# EAGLE design m0_lora (EAGLE 9.2.0)
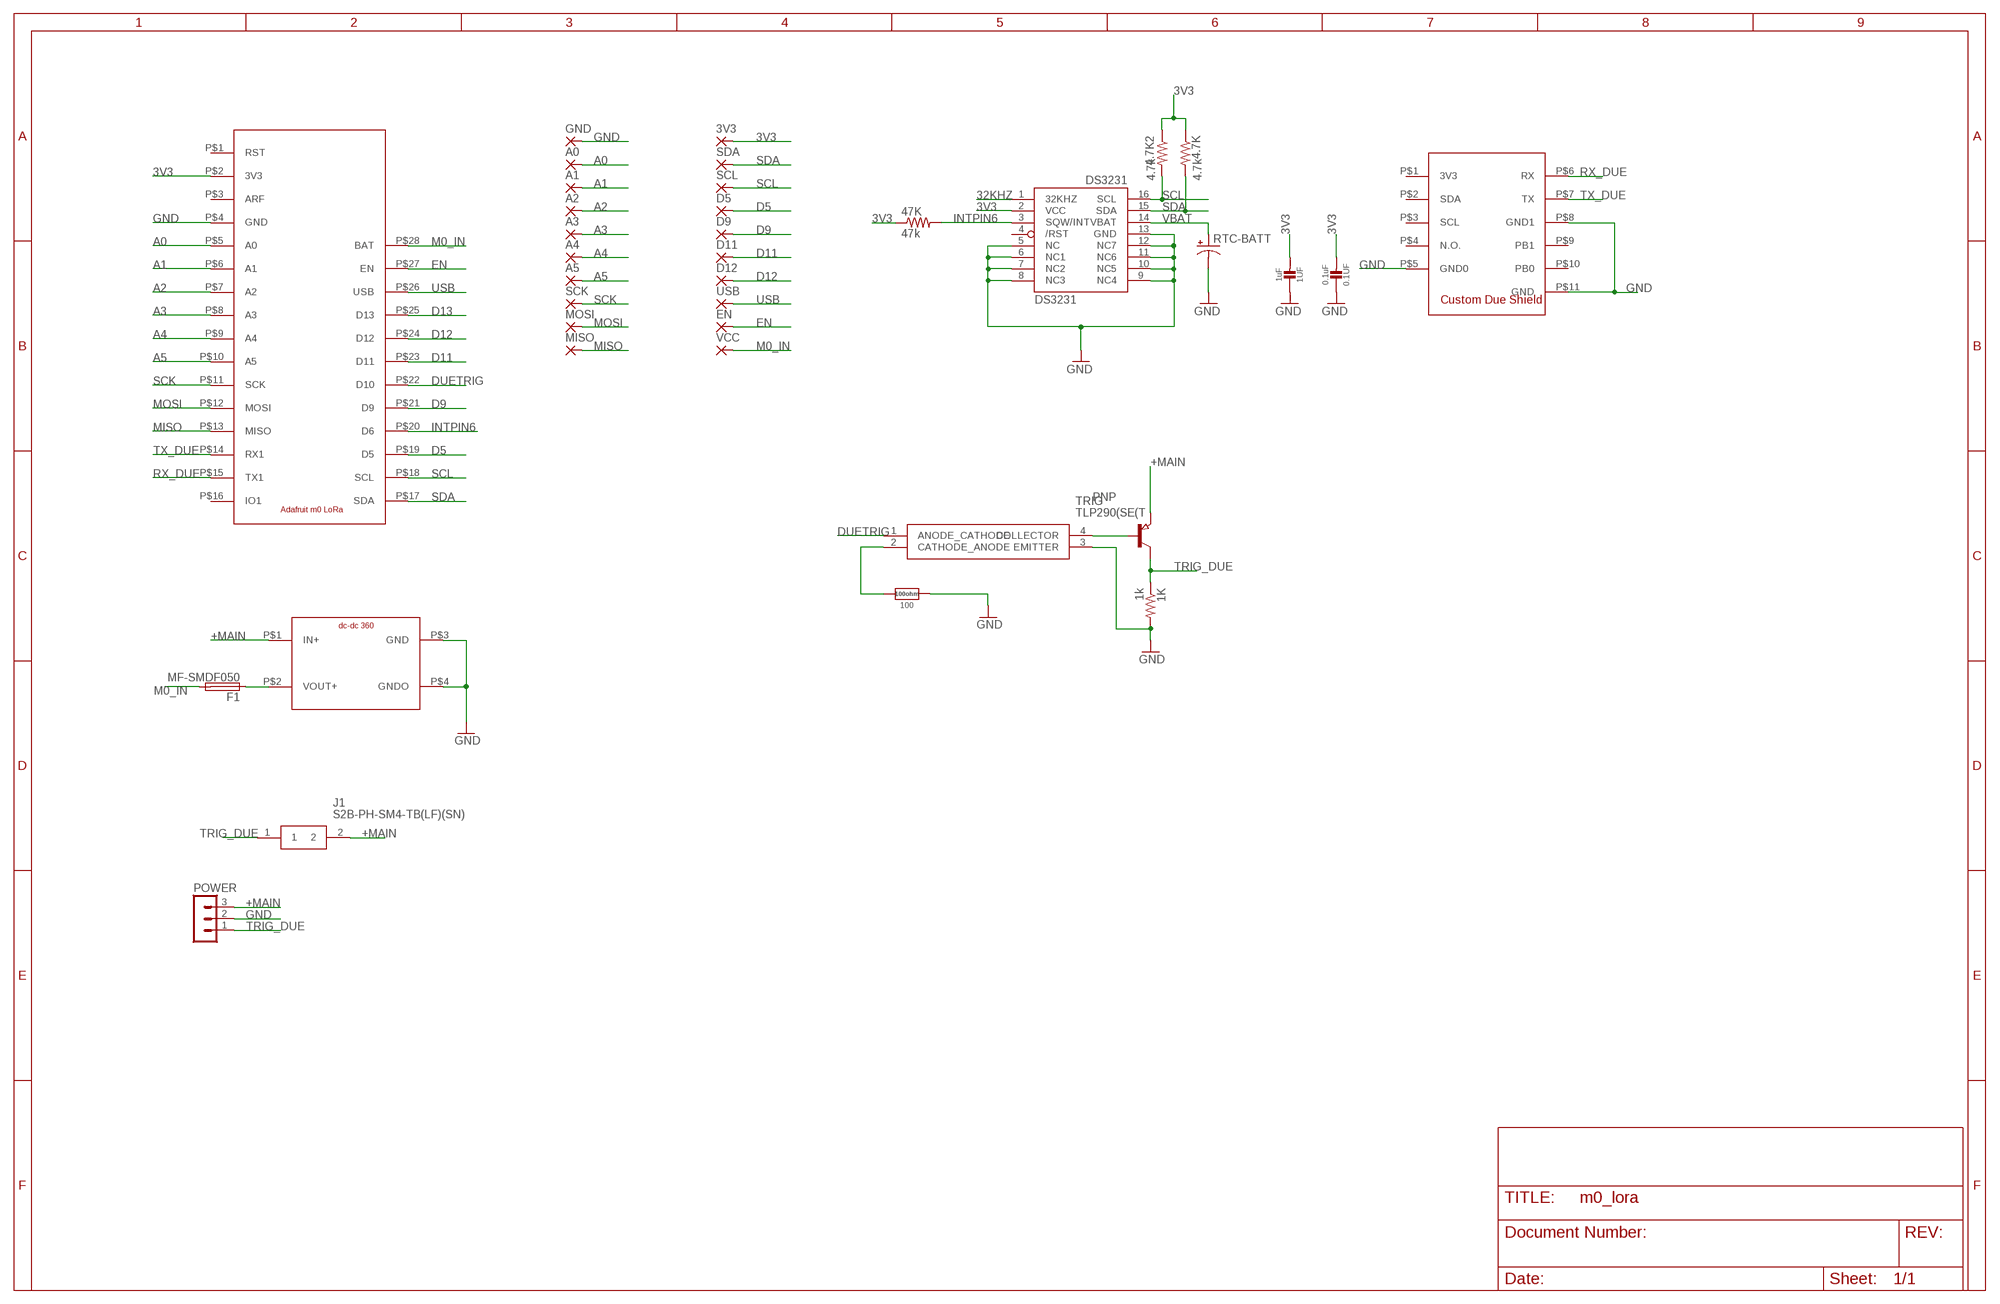
[diagram p0: schematic, sheet 1]

## Parts
0.1UF  0.1uF  CAP_CERAMIC0805-NOOUTLINE  [0805-NO]
1K  1k  R-US_R0805  [R0805]
1UF  1uF  CAP_CERAMIC0805-NOOUTLINE  [0805-NO]
3V3  SMD2  [SMD1,27-2,54]
4.7K  4.7k  R-US_R0805  [R0805]
4.7K2  4.7k  R-US_R0805  [R0805]
47K  47k  R-US_R0805  [R0805]
100  100ohm  RESISTOR0805_NOOUTLINE  [0805-NO]
A0  SMD2  [SMD1,27-2,54]
A1  SMD2  [SMD1,27-2,54]
A2  SMD2  [SMD1,27-2,54]
A3  SMD2  [SMD1,27-2,54]
A4  SMD2  [SMD1,27-2,54]
A5  SMD2  [SMD1,27-2,54]
D5  SMD2  [SMD1,27-2,54]
D9  SMD2  [SMD1,27-2,54]
D11  SMD2  [SMD1,27-2,54]
D12  SMD2  [SMD1,27-2,54]
DS3231  DS3231/SO  [SO16W]
EN  SMD2  [SMD1,27-2,54]
F1  MF-SMDF050  [MF-SMDF050]
GND  SMD2  [SMD1,27-2,54]
J1  S2B-PH-SM4-TB(LF)(SN)  [S2B-PH-SM4-TB]
MISO  SMD2  [SMD1,27-2,54]
MOSI  SMD2  [SMD1,27-2,54]
PNP  PNP-TRANSISTOR_SOT23  [SOT23]
POWER  MA03-1  [MA03-1]
RTC-BATT  CAP_POL6032  [EIA6032]
SCK  SMD2  [SMD1,27-2,54]
SCL  SMD2  [SMD1,27-2,54]
SDA  SMD2  [SMD1,27-2,54]
TRIG  TLP290(SE(T  [SOIC127P700X220-4N]
U$1  M0_LORA  [RFM69]
U$5  MINI-DC-DCDC-DC-2  [MINI-DC-DC-2]
U$6  DUE_PADS  [DUESHIELD]
USB  SMD2  [SMD1,27-2,54]
VCC  SMD2  [SMD1,27-2,54]

## Nets
3V3: 0.1UF.2 1UF.2 3V3.1(P) 4.7K2.1 4.7K.1 47K.1 DS3231.2(VCC) U$1.P$2(3V3)
32KHZ: DS3231.1(32KHZ)
+MAIN: J1.2 PNP.2(E) POWER.3 U$5.P$1(IN+)
A0: A0.1(P) U$1.P$5(A0)
A1: A1.1(P) U$1.P$6(A1)
A2: A2.1(P) U$1.P$7(A2)
A3: A3.1(P) U$1.P$8(A3)
A4: A4.1(P) U$1.P$9(A4)
A5: A5.1(P) U$1.P$10(A5)
D5: D5.1(P) U$1.P$19(D5)
D9: D9.1(P) U$1.P$21(D9)
D11: D11.1(P) U$1.P$23(D11)
D12: D12.1(P) U$1.P$24(D12)
D13: U$1.P$25(D13)
DUETRIG: TRIG.1(ANODE_CATHODE) U$1.P$22(D10)
EN: EN.1(P) U$1.P$27(EN)
GND: 0.1UF.1 1K.2 1UF.1 100.1 DS3231.5(NC) DS3231.6(NC1) DS3231.7(NC2) DS3231.8(NC3) DS3231.9(NC4) DS3231.10(NC5) DS3231.11(NC6) DS3231.12(NC7) DS3231.13(GND) GND.1(P) POWER.2 RTC-BATT.P$2(-) TRIG.3(EMITTER) U$1.P$4(GND) U$5.P$3(GND) U$5.P$4(GNDO) U$6.P$5(GND0) U$6.P$8(GND1) U$6.P$11(GND)
INTPIN6: 47K.2 DS3231.3(SQW/INT) U$1.P$20(D6)
M0_IN: F1.2 U$1.P$28(BAT) VCC.1(P)
MISO: MISO.1(P) U$1.P$13(MISO)
MOSI: MOSI.1(P) U$1.P$12(MOSI)
N$1: F1.1 U$5.P$2(VOUT+)
N$7: PNP.1(B) TRIG.4(COLLECTOR)
N$16: 100.2 TRIG.2(CATHODE_ANODE)
RX_DUE: U$1.P$15(TX1) U$6.P$6(RX)
SCK: SCK.1(P) U$1.P$11(SCK)
SCL: 4.7K2.2 DS3231.16(SCL) SCL.1(P) U$1.P$18(SCL)
SDA: 4.7K.2 DS3231.15(SDA) SDA.1(P) U$1.P$17(SDA)
TRIG_DUE: 1K.1 J1.1 PNP.3(C) POWER.1
TX_DUE: U$1.P$14(RX1) U$6.P$7(TX)
USB: U$1.P$26(USB) USB.1(P)
VBAT: DS3231.14(VBAT) RTC-BATT.P$1(+)
Unconnected: DS3231.4(/RST) U$1.P$1(RST) U$1.P$3(ARF) U$1.P$16(IO1) U$6.P$1(3V3) U$6.P$2(SDA) U$6.P$3(SCL) U$6.P$4(N.O.) U$6.P$9(PB1) U$6.P$10(PB0)

## Library data of the parts
0.1UF 1UF = microbuilder:CAP_CERAMIC: Ceramic Capacitors For new designs, use the packages preceded by an '_' character since they are more reliable: The following footprints should be used on most boards: _0402 - Standard footprint for regular board layouts _0603 - Standard footprint for regular board layouts _0805 - Standard footprint for regular board layouts _1206 - Standard footprint for regular board layouts For extremely tight-pitch boards where space is at a premium, the following 'micro-pitch' footprints can be used (smaller pads, no silkscreen outline, etc.): _0402MP - Micro-pitch footprint for very dense/compact boards _0603MP - Micro-pitch footprint for very dense/compact boards _0805MP - Micro-pitch footprint for very dense/compact boards _1206MP - Micro-pitch footprint for very dense/compact boards
1K 4.7K 4.7K2 47K = rcl:R-US_: RESISTOR, American symbol; SPICEPREFIX: R
3V3 A0 A1-A5 D5 D9 D11 D12 EN GND MISO MOSI SCK SCL SDA USB VCC = wirepad:SMD2: SMD PAD
100 = microbuilder:RESISTOR: Resistors For new designs, use the packages preceded by an '_' character since they are more reliable: The following footprints should be used on most boards: _0402 - Standard footprint for regular board layouts _0603 - Standard footprint for regular board layouts _0805 - Standard footprint for regular board layouts _1206 - Standard footprint for regular board layouts For extremely tight-pitch boards where space is at a premium, the following 'micro-pitch' footprints can be used (smaller pads, no silkscreen outline, etc.): _0402MP - Micro-pitch footprint for very dense/compact boards _0603MP - Micro-pitch footprint for very dense/compact boards _0805MP - Micro-pitch footprint for very dense/compact boards _1206MP - Micro-pitch footprint for very dense/compact boards
DS3231 = adafruit:DS3231
F1 = fuse:MF-SMDF: MF-SMDF Series - PRC Resettable Fuses Source: http://www.farnell.com/datasheets/716597.pdf
J1 = S2B-PH-SM4-TB(LF)(SN):S2B-PH-SM4-TB(LF)(SN): PH SMT side entry shroud header 2 way JST PH Series, 2mm Pitch 2 Way 1 Row Right Angle PCB Header, Solder Termination, 2A Source: Datasheet <http://uk.rs-online.com/web/p/products/6881353P>; DESCRIPTION: PH SMT side entry shroud header 2 way JST PH Series, 2mm Pitch 2 Way 1 Row Right Angle PCB Header, Solder Termination, 2A; HEIGHT: mm; MANUFACTURER_NAME: JST (JAPAN SOLDERLESS TERMINALS); MANUFACTURER_PART_NUMBER: S2B-PH-SM4-TB(LF)(SN); RS_PART_NUMBER: 6881353P; RS_PRICE-STOCK: http://uk.rs-online.com/web/p/products/6881353P
PNP = semicon-smd-ipc:PNP-TRANSISTOR_: PNP TRANSISTOR
POWER = con-lstb:MA03-1: PIN HEADER; OC_FARNELL: unknown; OC_NEWARK: unknown
RTC-BATT = SparkFun-Passives:CAP_POL: Capacitor Polarized These are standard SMD and PTH capacitors. Normally 10uF, 47uF, and 100uF in electrolytic and tantalum varieties. Always verify the external diameter of the through hole cap, it varies with capacity, voltage, and manufacturer. The EIA devices should be standard.
TRIG = SamacSys_Parts:TLP290(SE(T: Photocoupler, Tr, 2.3mm, AC, SO4 Source: Datasheet <http://uk.rs-online.com/web/p/products/8851086P>; DESCRIPTION: Photocoupler, Tr, 2.3mm, AC, SO4; HEIGHT: 2.2mm; MANUFACTURER_NAME: Toshiba; MANUFACTURER_PART_NUMBER: TLP290(SE(T; RS_PART_NUMBER: 8851086P; RS_PRICE-STOCK: http://uk.rs-online.com/web/p/products/8851086P
U$1 = m0_LoRa:M0_LORA
U$5 = mini DC-DC 360:MINI-DC-DC
U$6 = due_shield_pad:DUE_PADS

## Board
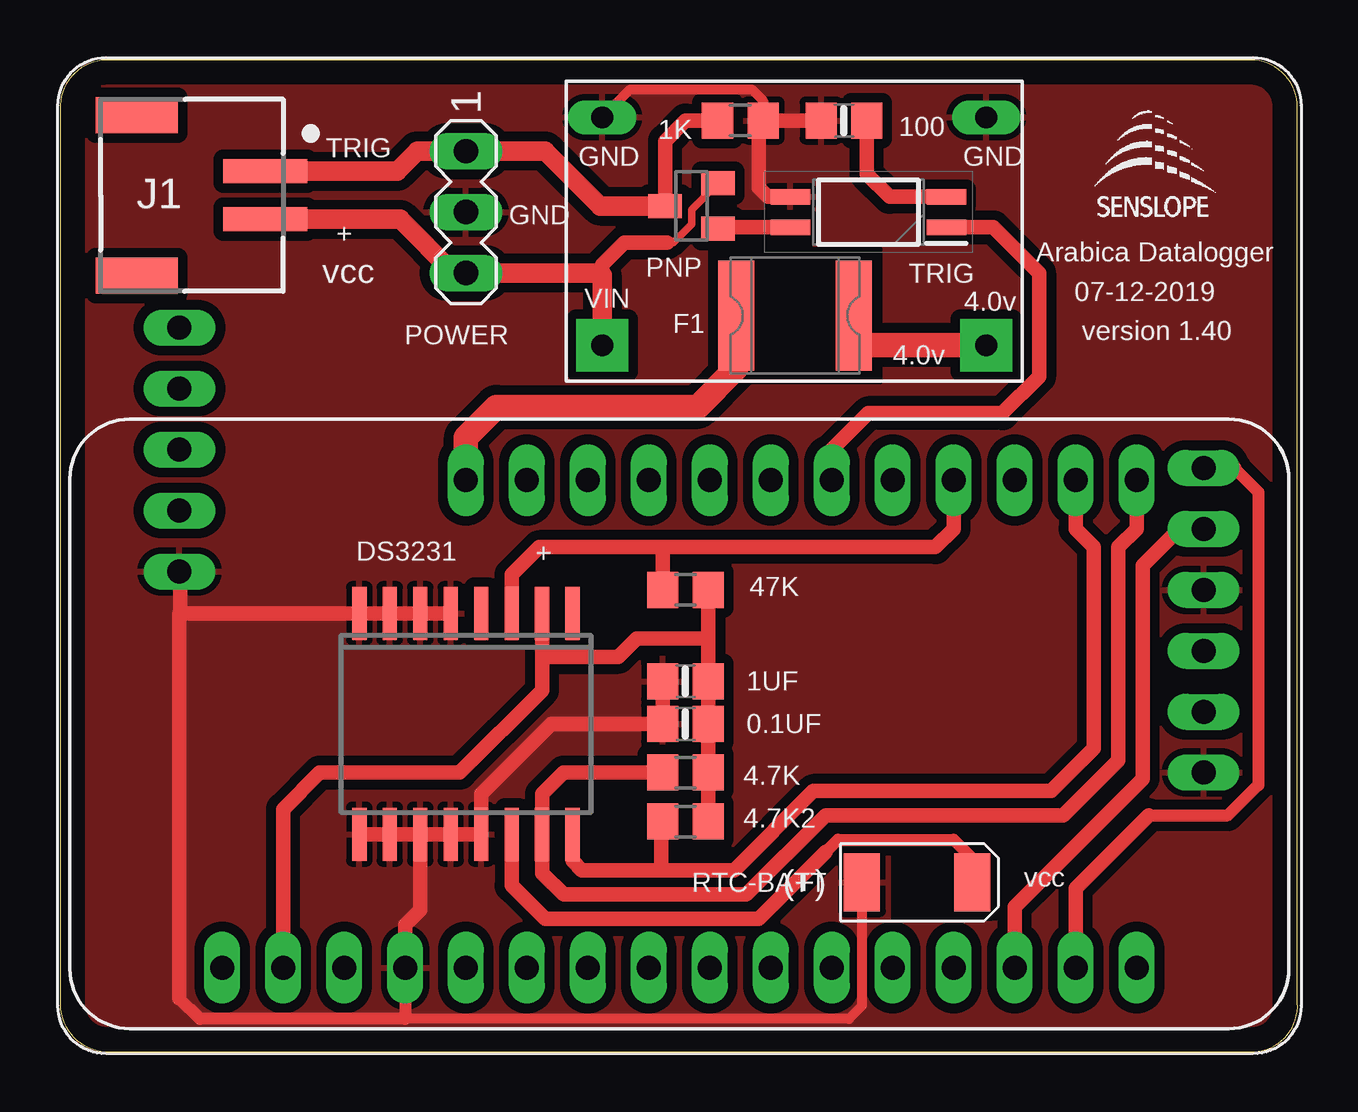
[diagram p1: board, top side]
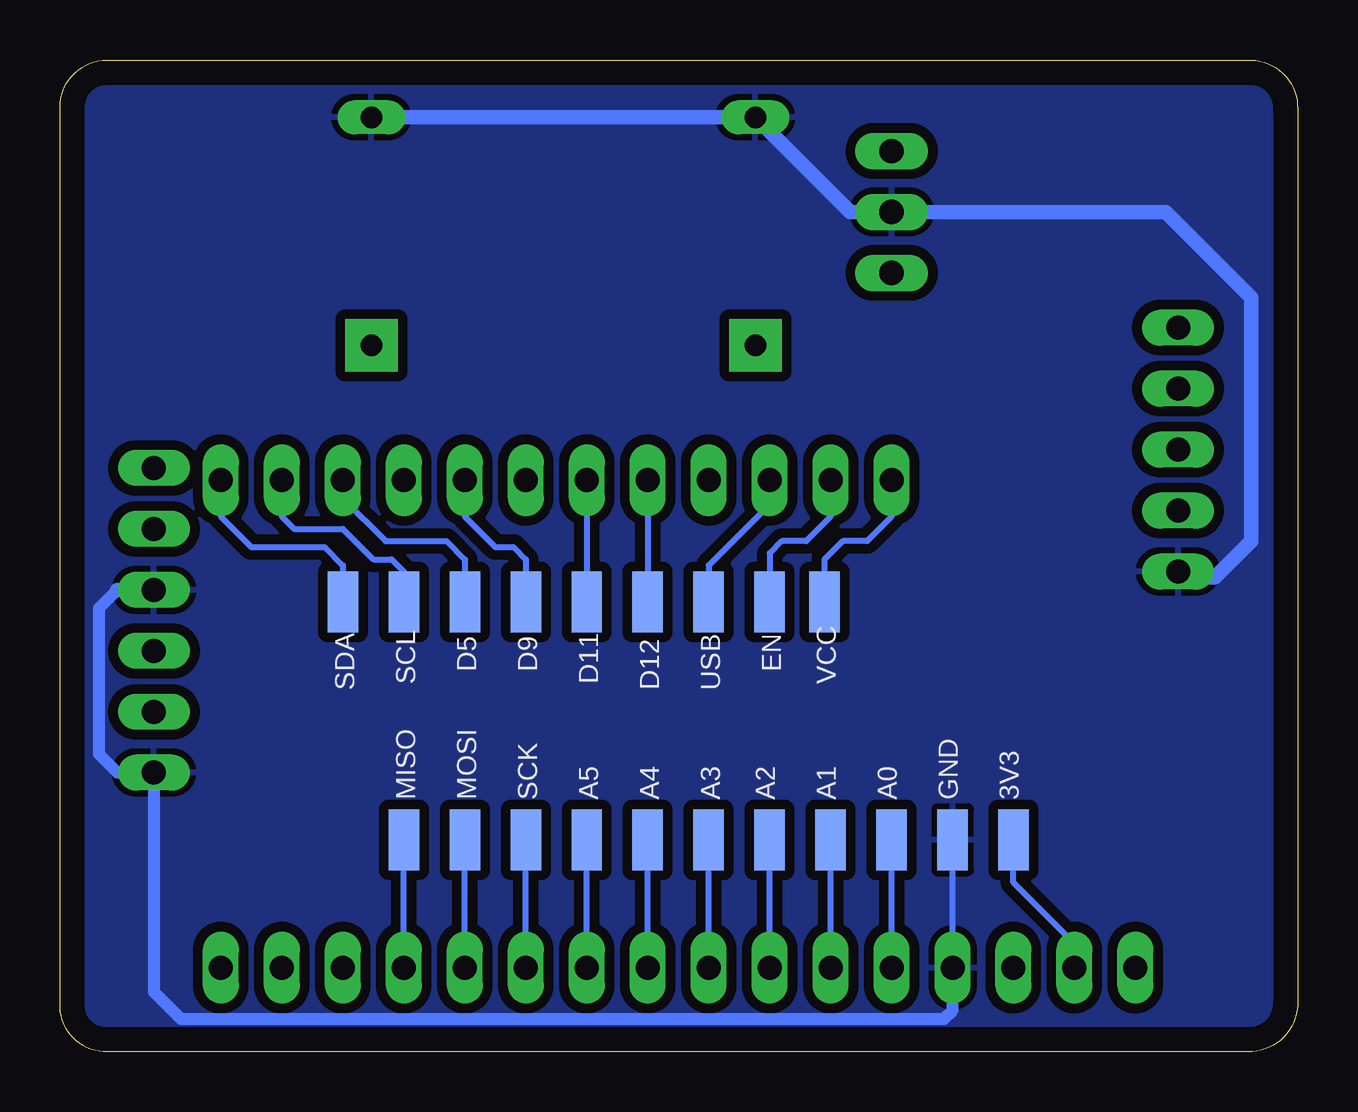
[diagram p2: board, bottom side, seen from below]

Size 51.56 x 41.34 mm. Coordinates in mm from the lower left corner, seen from the top.
Outline: 49.61,41.34 1.93,41.34 arc90 0,39.28 0,1.96 arc90 2.08,0 49.76,0 arc90 51.56,2.03 51.56,39.36 arc90 49.61,41.34
Copper layers (1*16): Top 0.035mm / dielectric 1.5mm / Bottom 0.035mm
Design rules "default": minimum track width 6mil, minimum drill 0.35mm, track to track 6mil, track to pad 6mil, pad to pad 6mil, via to via 6mil, smd to smd 6mil, copper to edge 40mil, drill to drill 6mil, minimum pad ring 10mil, minimum via ring 8mil, stop-mask expansion 4mil, vias tented up to drill 0mil, thermal gap 10mil

### Footprints (pad centres in the part's own frame; a part is rotated, then mirrored left to right if it is on the bottom)
0805-NO = smd 1.3 x 1.5: 1 -0.95,0; 2 0.95,0
R0805 = smd 1.3 x 1.5: 1 -0.95,0; 2 0.95,0
SMD1,27-2,54 = smd 1.27 x 2.54: 1 0,0
SO16W = smd 0.6 x 2.2: 1 -4.445,-4.6; 2 -3.175,-4.6; 3 -1.905,-4.6; 4 -0.635,-4.6; 5 0.635,-4.6; 6 1.905,-4.6; 7 3.175,-4.6; 8 4.445,-4.6; 9 4.445,4.6; 10 3.175,4.6; 11 1.905,4.6; 12 0.635,4.6; 13 -0.635,4.6; 14 -1.905,4.6; 15 -3.175,4.6; 16 -4.445,4.6
MF-SMDF050 = smd 1.5 x 4.6: 1 -2.45,0; 2 2.45,0
S2B-PH-SM4-TB = smd 1 x 3.5: 1 5,0.75; 2 3,0.75 | smd 1.5 x 3.4: 3 0.65,6.1; 4 7.35,6.1
SOT23 = smd 1 x 1.4: 1 -0.95,-1.1; 2 0.95,-1.1; 3 0,1.1
MA03-1 = drill 1.016 long: 1 -2.54,0; 2 0,0; 3 2.54,0
EIA6032 = smd 1.5 x 2.4: P$1 -2.3,0; P$2 2.3,0
SOIC127P700X220-4N = smd 1.65 x 0.65: 1 -3.25,0.635; 2 -3.25,-0.635; 3 3.25,-0.635; 4 3.25,0.635
RFM69 = drill 1 long: P$1 -10.16,21.59; P$2 -10.16,19.05; P$3 -10.16,16.51; P$4 -10.16,13.97; P$5 -10.16,11.43; P$6 -10.16,8.89; P$7 -10.16,6.35; P$8 -10.16,3.81; P$9 -10.16,1.27; P$10 -10.16,-1.27; P$11 -10.16,-3.81; P$12 -10.16,-6.35; P$13 -10.16,-8.89; P$14 -10.16,-11.43; P$15 -10.16,-13.97; P$16 -10.16,-16.51; P$17 10.16,-16.51; P$18 10.16,-13.97; P$19 10.16,-11.43; P$20 10.16,-8.89; P$21 10.16,-6.35; P$22 10.16,-3.81; P$23 10.16,-1.27; P$24 10.16,1.27; P$25 10.16,3.81; P$26 10.16,6.35; P$27 10.16,8.89; P$28 10.16,11.43
MINI-DC-DC-2 = drill 0.9 pad 2.184 square: P$1 -5.5,-2.5; P$2 10.5,-2.5 | drill 0.9 pad 1.422 long: P$3 -5.5,7; P$4 10.5,7
DUESHIELD = drill 1 long: P$1 -21.082,8.89; P$2 -21.082,6.35; P$3 -21.082,3.81; P$4 -21.082,1.27; P$5 -21.082,-1.27; P$6 21.59,3.048; P$7 21.59,0.508; P$8 21.59,-2.032; P$9 21.59,-4.572; P$10 21.59,-7.112; P$11 21.59,-9.652

### Placement (x,y rotation side)
0.1UF  26.06,13.67 0 top
1K  28.35,38.81 0 top
1UF  26.06,15.44 0 top
3V3  11.84,8.84 0 bottom
4.7K  26.06,11.63 180 top
4.7K2  26.06,9.6 180 top
47K  26.06,19.25 180 top
100  32.66,38.81 0 top
A0  16.92,8.84 0 bottom
A1  19.46,8.84 0 bottom
A2  22,8.84 0 bottom
A3  24.54,8.84 0 bottom
A4  27.08,8.84 0 bottom
A5  29.62,8.84 0 bottom
D5  34.7,18.75 0 bottom
D9  32.16,18.75 0 bottom
D11  29.62,18.75 0 bottom
D12  27.08,18.75 0 bottom
DS3231  16.92,13.67 180 top
EN  22,18.75 0 bottom
F1  30.63,30.68 180 top
GND  14.38,8.84 0 bottom
J1  9.3,31.7 90 top
MISO  37.24,8.84 0 bottom
MOSI  34.7,8.84 0 bottom
PNP  26.31,35.26 90 top
POWER  16.92,35 270 top
RTC-BATT  35.71,7.06 180 top
SCK  32.16,8.84 0 bottom
SCL  37.24,18.75 0 bottom
SDA  39.78,18.75 0 bottom
TRIG  33.68,35 180 top
U$1  28.35,13.67 90 top
U$2  [LOGO_SML_TNAME]  45.42,36.43 0 top
U$5  28.09,31.95 0 top
U$6  26.06,21.29 0 top
USB  24.54,18.75 0 bottom
VCC  19.71,18.75 0 bottom

### Tracks (layer width: path | path; a pad name or v marks a point on that pad's centre or on a via)
3V3
  Top 0.61: U$1.P$2 9.3,10.11 10.82,11.63 16.66,11.63 20.09,15.06 20.09,16.46 | 20.09,16.46 DS3231.2 | 20.09,16.46 23.27,16.46 24.03,17.22 27.01,17.22 | 47K.1 27.01,17.22 | 27.01,17.22 1UF.2 0.1UF.2 4.7K.1 4.7K2.1
  Bottom 0.254: U$1.P$2 9.3,4.52 11.84,7.06 3V3.1
+MAIN
  Top 0.305: PNP.2 26.31,35.11 26.31,34.49 25.55,33.73 25.3,33.73
  Top 0.61: 25.3,33.73 23.52,33.73 22.59,32.8 U$5.P$1
  Top 0.813: J1.2 14.17,34.7 16.41,32.46 POWER.3 22.5,32.46 22.59,32.37 U$5.P$1
A0
  Bottom 0.254: U$1.P$5 A0.1
A1
  Bottom 0.254: U$1.P$6 A1.1
A2
  Bottom 0.254: U$1.P$7 A2.1
A3
  Bottom 0.254: U$1.P$8 A3.1
A4
  Bottom 0.254: U$1.P$9 A4.1
A5
  Bottom 0.254: U$1.P$10 A5.1
D5
  Bottom 0.254: U$1.P$19 39.78,23.06 38,21.29 35.46,21.29 34.7,20.52 D5.1
D9
  Bottom 0.254: U$1.P$21 34.7,22.3 33.43,21.03 32.66,21.03 32.16,20.52 D9.1
D11
  Bottom 0.254: U$1.P$23 D11.1
D12
  Bottom 0.254: U$1.P$24 D12.1
DUETRIG
  Top 0.61: U$1.P$22 32.16,25.1 33.68,26.62 39.27,26.62 40.79,28.14 40.79,32.46 38.89,34.37 TRIG.1
EN
  Bottom 0.254: U$1.P$27 19.46,22.3 20.47,21.29 21.49,21.29 22,20.78 EN.1
GND
  Top 0.406: U$5.P$3 23.76,40.12 28.81,40.12 29.3,39.64 1K.2 | 14.38,1.37 32.87,1.37 33.41,1.92 RTC-BATT.P$2
  Top 0.508: 4.98,2.24 5.84,1.37 14.38,1.37 U$1.P$4 | 1K.2 29.11,38.62
  Top 0.61: DS3231.11 DS3231.12 DS3231.13 17.55,10.74 20.47,13.67 0.1UF.1 1UF.1 | DS3231.11 DS3231.10 DS3231.9 | DS3231.11 15.01,5.92 14.38,5.28 U$1.P$4 | DS3231.5 DS3231.6 DS3231.7 DS3231.8 5.01,18.27 | 1K.2 100.1 | TRIG.3 29.49,35.64 29.11,36.02 29.11,38.62 | 4.98,2.24 4.98,18.24 5.01,18.27 | U$6.P$5 5.01,19.99 5.01,18.27
  Bottom 0.254: U$1.P$4 GND.1
  Bottom 0.508: U$1.P$4 14.38,1.73 14.73,1.37 46.53,1.37 47.65,2.49 U$6.P$11 49.17,11.63 49.94,12.4 49.94,18.49 49.17,19.25
  Bottom 0.61: U$5.P$4 U$5.P$3 18.64,35 POWER.2 5.49,35 1.93,31.45 1.93,21.29 3.45,19.76 4.72,19.76 U$6.P$5 | U$6.P$8 49.17,19.25
  pour Top (isolate 0.406): 49.43,0.2 2.18,0.2 arc-90 0.15,2.24 0.15,39.07 arc-90 2.18,41.1 49.43,41.1 arc-90 51.46,39.07 51.46,2.24 arc-90
  pour Bottom (isolate 0.406): 49.43,0.2 2.18,0.2 arc-90 0.15,2.24 0.15,39.07 arc-90 1.93,40.84 49.68,40.84 arc-90 51.46,39.07 51.46,2.24 arc-90
INTPIN6
  Top 0.61: DS3231.3 18.82,19.89 19.96,21.03 25.04,21.03 | 25.04,21.03 36.47,21.03 37.24,21.79 U$1.P$20 | 47K.2 25.11,20.97 25.04,21.03
M0_IN
  Top 1.016: U$1.P$28 16.92,25.6 18.19,26.87 26.57,26.87 28.18,28.49 F1.2
  Bottom 0.254: U$1.P$28 16.92,22.3 17.93,21.29 18.95,21.29 19.71,20.52 VCC.1
MISO
  Bottom 0.254: U$1.P$13 MISO.1
MOSI
  Bottom 0.254: U$1.P$12 MOSI.1
N$1
  Top 1.016: U$5.P$2 33.39,29.45 33.08,29.76 F1.1
N$2
  cutout Top: 27.08,33.48 34.19,33.48 34.19,27.89 27.08,27.89
N$3
  cutout Top: 34.7,9.09 34.7,5.54 39.01,5.54 39.27,5.54 39.27,9.09
N$7
  Top 0.61: TRIG.4 27.48,34.37 PNP.1
N$16
  Top 0.61: TRIG.2 34.57,35.64 33.61,36.59 100.2
RX_DUE
  Top 0.508: 45.36,9.86 48.67,9.86 49.93,11.12 49.93,11.38 49.93,23.32 48.92,24.33
  Top 0.61: U$1.P$15 42.32,6.81 45.36,9.86 | U$6.P$6 48.92,24.33
SCK
  Bottom 0.254: U$1.P$11 SCK.1
SCL
  Top 0.61: U$1.P$18 42.32,21.79 43.08,21.03 43.08,12.65 41.3,10.87 31.39,10.87 28.09,7.57 25.04,7.57 | DS3231.16 21.36,7.95 21.74,7.57 25.04,7.57 | 4.7K2.2 25.04,9.54 25.04,7.57
  Bottom 0.254: U$1.P$18 42.32,22.3 41.81,21.79 39.78,21.79 38.51,20.52 37.74,20.52 37.24,20.02 SCL.1
SDA
  Top 0.61: U$1.P$17 44.86,21.79 44.09,21.03 44.09,12.14 41.81,9.86 31.9,9.86 28.6,6.55 20.98,6.55 20.09,7.44 DS3231.15 20.09,10.74 20.98,11.63 4.7K.2
  Bottom 0.254: U$1.P$17 44.86,22.3 43.59,21.03 40.54,21.03 39.78,20.27 SDA.1
TRIG_DUE
  Top 0.61: PNP.3 25.21,37.97 26.06,38.81 1K.1
  Top 0.813: J1.1 14.04,36.7 14.88,37.54 POWER.1 20.22,37.54 22.5,35.26 PNP.3
TX_DUE
  Top 0.61: U$1.P$14 39.78,6.05 45.11,11.38 45.11,20.27 46.63,21.79 U$6.P$7
USB
  Bottom 0.254: U$1.P$26 22,22.81 24.54,20.27 USB.1
VBAT
  Top 0.508: 31.9,8.33 32.41,8.84 37.24,8.84 38,8.08 arc-45 38.01,8.04 RTC-BATT.P$1
  Top 0.61: DS3231.14 18.82,6.93 20.22,5.54 29.11,5.54 31.9,8.33

### Text on the board
tNames: TRIG | GND | GND | GND | + | Arabica Datalogger | vcc | VIN | 4.0v | 07-12-2019 | version 1.40 | 4.0v | + | (+) | vcc